# Altium schematic sheet Sheet1.SchDoc
size A4; SheetNumber: 1; SheetTotal: 1
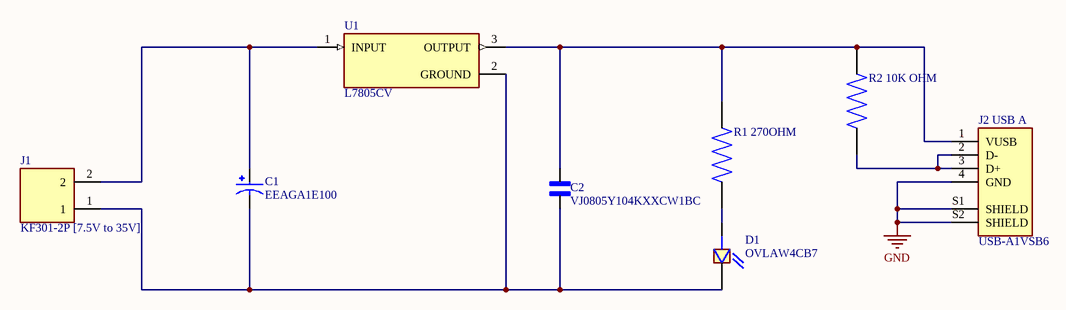
[diagram p0: Sheet1.SchDoc]

## Parts
C1  EEAGA1E100  [CAPPRD150W45D400H700]
C2  VJ0805Y104KXXCW1BC  [CAPC2012X90N]
D1  OVLAW4CB7  [LEDRD254W50D305H520P]
J1  KF301-2P [7.5V to 35V]  [HANDSON_KF301-2P]
J2_USB_A  USB-A1VSB6  [ONSHORE_USB-A1VSB6]
R1_270OHM  MFR-25FBF52-1K  [RESAD1100W55L680D260]  (value not drawn)
R2_10K_OHM  MFR-25FBF52-1K  [RESAD1100W55L680D260]  (value not drawn)
U1  L7805CV  [TO255P1040X460X1968-3]

## Nets
GND: J2_USB_A.4(GND) J2_USB_A.S1(SHIELD) J2_USB_A.S2(SHIELD)
NetC1_N: C1.N C2.1 D1.C J1.1 U1.2(GROUND)
NetC1_P: C1.P J1.2 U1.1(INPUT)
NetC2_2: C2.2 J2_USB_A.1(VUSB) R1_270OHM.2 R2_10K_OHM.2 U1.3(OUTPUT)
NetD1_A: D1.A R1_270OHM.1
NetJ2_USB_A_2: J2_USB_A.2(D-) J2_USB_A.3(D+) R2_10K_OHM.1

## Library data of the parts
C1 = EEAGA1E100: CAP ALUM 10UF 20% 25V RADIAL; MF: Panasonic; MP: EEA-GA1E100; Package: RADIAL-2 Panasonic; Price: None; Check_prices: https://www.snapeda.com/parts/EEA-GA1E100/Panasonic/view-part/2301584/?ref=eda; Value: *; SnapEDA_Link: https://www.snapeda.com/parts/EEA-GA1E100/Panasonic/view-part/2301584/?ref=snap; Availability: In Stock
C2 = VJ0805Y104KXXCW1BC: Capacitor: ceramic; MLCC; 100nF; 25V; X7R; Â±10%; SMD; 0805; MF: Vishay Vitramon; SnapEDA_Link: https://www.snapeda.com/parts/VJ0805Y104KXXCW1BC/Vishay/view-part/?ref=snap; Package: 0805-2 VISHAY; Value: *; MP: VJ0805Y104KXXCW1BC; Check_prices: https://www.snapeda.com/parts/VJ0805Y104KXXCW1BC/Vishay/view-part/?ref=eda
D1 = OVLAW4CB7: Ovlaw4Cb7 White LED 3mm (T-1) Round Lens Through Hole Package | Optek (TT Electronics) OVLAW4CB7; MF: TT Electronics/Optek; SnapEDA_Link: https://www.snapeda.com/parts/OVLAW4CB7/TT+Electronics%252FOptek/view-part/?ref=snap; Package: Package; Value: *; MP: OVLAW4CB7; Check_prices: https://www.snapeda.com/parts/OVLAW4CB7/TT+Electronics%252FOptek/view-part/?ref=eda
J1 = KF301-2P: 2 Pin Terminal Block 5mm Pitch; MF: Handson Technology; SnapEDA_Link: https://www.snapeda.com/parts/KF301-2P/Handson+Technology/view-part/?ref=snap; Package: None; Value: *; MP: KF301-2P; Check_prices: https://www.snapeda.com/parts/KF301-2P/Handson+Technology/view-part/?ref=eda
J2_USB_A = USB-A1VSB6: USB-A (USB TYPE-A) - Receptacle Connector 4 Position Through Hole; MF: On Shore; Check_prices: https://www.snapeda.com/parts/USB-A1VSB6/On+Shore+Technology+Inc./view-part/?ref=eda; Value: *; Availability: In Stock; MP: USB-A1VSB6; Price: None; Package: None; SnapEDA_Link: https://www.snapeda.com/parts/USB-A1VSB6/On+Shore+Technology+Inc./view-part/?ref=snap; Purchase-URL: https://pricing.snapeda.com/search/part/USB-A1VSB6/?ref=eda
R1_270OHM R2_10K_OHM = MFR-25FBF52-1K: 1.07 kOhms Â±1% 0.25W, 1/4W Through Hole Resistor Axial - Metal Film; MF: Yageo; SnapEDA_Link: https://www.snapeda.com/parts/MFR-25FBF52-1K/Yageo/view-part/?ref=snap; Package: RADIAL-2 YAGEO; Value: *; MP: MFR-25FBF52-1K; Check_prices: https://www.snapeda.com/parts/MFR-25FBF52-1K/Yageo/view-part/?ref=eda
U1 = L7805CV: Linear Voltage Regulator IC Positive Fixed 1 Output 1.5A TO-220; MF: STMicroelectronics; SnapEDA_Link: https://www.snapeda.com/parts/L7805CV/STMicroelectronics/view-part/?ref=snap; Package: TO-220-3 STMicroelectronics; Value: *; MP: L7805CV; Check_prices: https://www.snapeda.com/parts/L7805CV/STMicroelectronics/view-part/?ref=eda